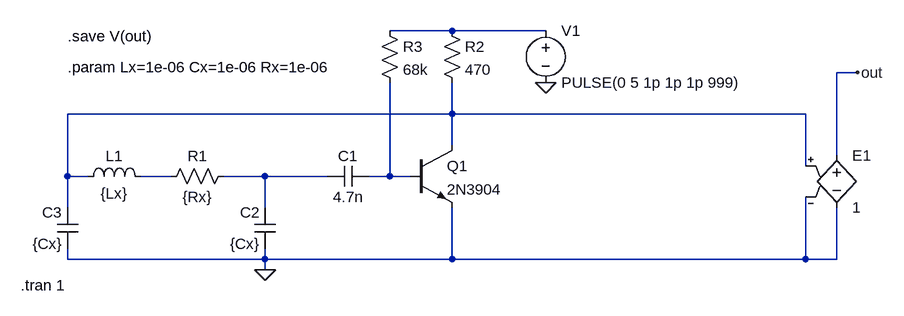
[diagram p0: schematic test.asc]
test.asc, the LTspice schematic file:
Version 4
SHEET 1 1260 680
WIRE -160 32 -256 32
WIRE -16 32 -160 32
WIRE 464 96 432 96
WIRE -160 160 -160 112
WIRE -160 160 -752 160
WIRE 384 160 -160 160
WIRE -160 208 -160 160
WIRE 432 224 432 96
WIRE 384 240 384 160
WIRE -752 256 -752 160
WIRE -720 256 -752 256
WIRE -592 256 -640 256
WIRE -448 256 -512 256
WIRE -352 256 -448 256
WIRE -256 256 -256 112
WIRE -256 256 -288 256
WIRE -224 256 -256 256
WIRE -752 304 -752 256
WIRE -448 304 -448 256
WIRE -752 384 -752 368
WIRE -448 384 -448 368
WIRE -448 384 -752 384
WIRE -160 384 -160 304
WIRE -160 384 -448 384
WIRE 384 384 384 288
WIRE 384 384 -160 384
WIRE 432 384 432 304
WIRE 432 384 384 384
WIRE -448 400 -448 384
FLAG -448 400 0
FLAG -16 112 0
FLAG 464 96 out
SYMBOL npn -224 208 R0
SYMATTR InstName Q1
SYMATTR Value 2N3904
SYMBOL cap -288 240 R90
WINDOW 0 0 32 VBottom 2
WINDOW 3 32 32 VTop 2
SYMATTR InstName C1
SYMATTR Value 4.7n
SYMBOL cap -432 368 R180
WINDOW 0 24 56 Left 2
WINDOW 3 24 8 Left 2
SYMATTR InstName C2
SYMATTR Value {Cx}
SYMBOL res -496 240 R90
WINDOW 0 0 56 VBottom 2
WINDOW 3 32 56 VTop 2
SYMATTR InstName R1
SYMATTR Value {Rx}
SYMBOL ind -736 272 R270
WINDOW 0 32 56 VTop 2
WINDOW 3 5 56 VBottom 2
SYMATTR InstName L1
SYMATTR Value {Lx}
SYMBOL cap -736 368 R180
WINDOW 0 24 56 Left 2
WINDOW 3 24 8 Left 2
SYMATTR InstName C3
SYMATTR Value {Cx}
SYMBOL res -176 16 R0
SYMATTR InstName R2
SYMATTR Value 470
SYMBOL res -272 16 R0
SYMATTR InstName R3
SYMATTR Value 68k
SYMBOL voltage -16 16 R0
WINDOW 123 0 0 Left 0
WINDOW 39 0 0 Left 0
SYMATTR InstName V1
SYMATTR Value PULSE(0 5 1p 1p 1p 999)
SYMBOL e 432 208 R0
SYMATTR InstName E1
SYMATTR Value 1
TEXT -824 424 Left 2 !.tran 1
TEXT -752 88 Left 2 !.param Lx=1e-06 Cx=1e-06 Rx=1e-06
TEXT -752 40 Left 2 !.save V(out)

The netlist it stands for:
* test.asc
Q1 N002 N005 0 0 2N3904
C1 N005 N004 4.7n
C2 0 N004 {Cx}
R1 N004 N003 {Rx}
L1 N002 N003 {Lx}
C3 0 N002 {Cx}
R2 N001 N002 470
R3 N001 N005 68k
V1 N001 0 PULSE(0 5 1p 1p 1p 999)
E1 out 0 N002 0 1
.model NPN NPN
.model PNP PNP
.lib standard.bjt
.tran 1
.param Lx=1e-06 Cx=1e-06 Rx=1e-06
.save V(out)
.backanno
.end